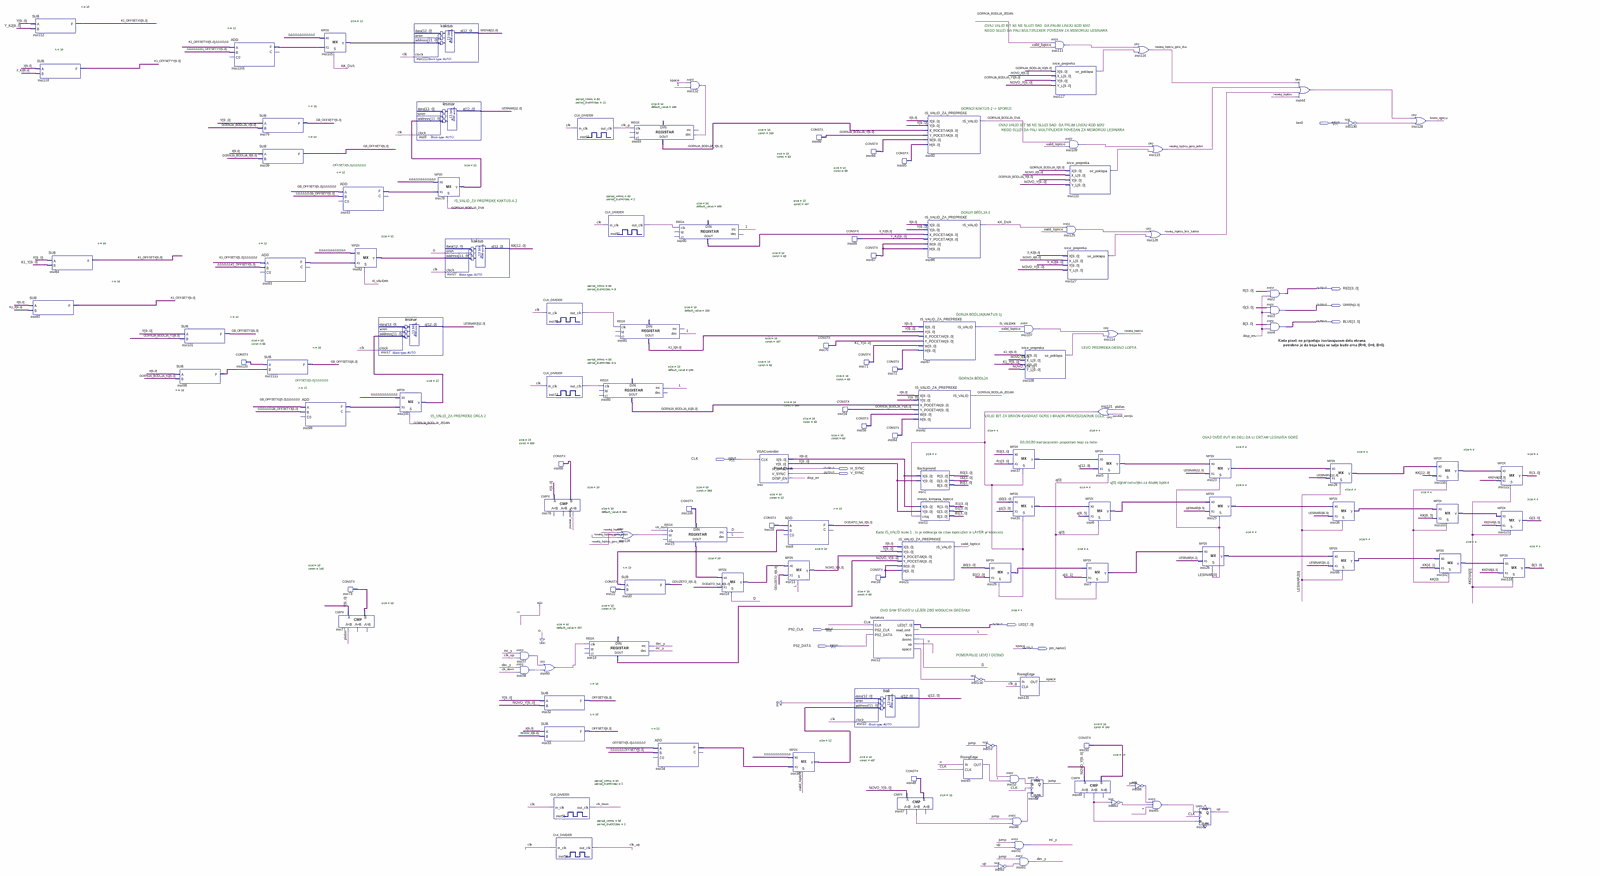
[diagram p0: schematic sheet, whole]
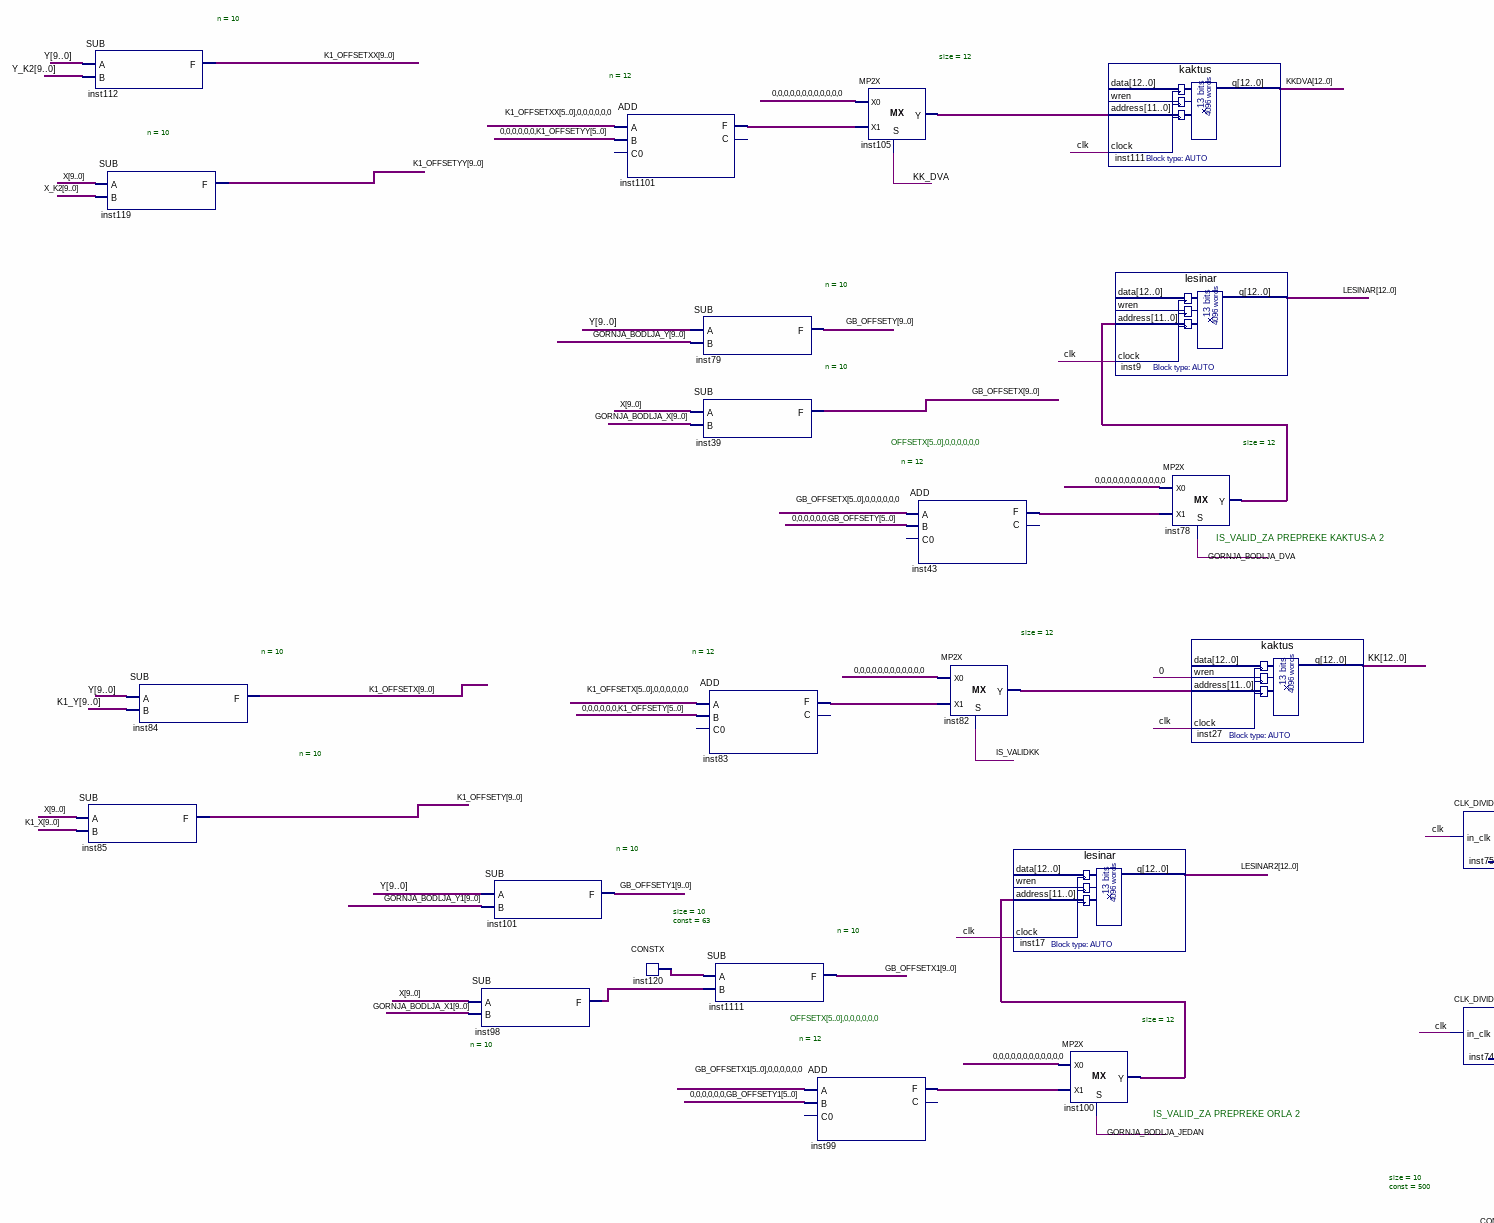
[diagram p1: schematic sheet, upper left part]
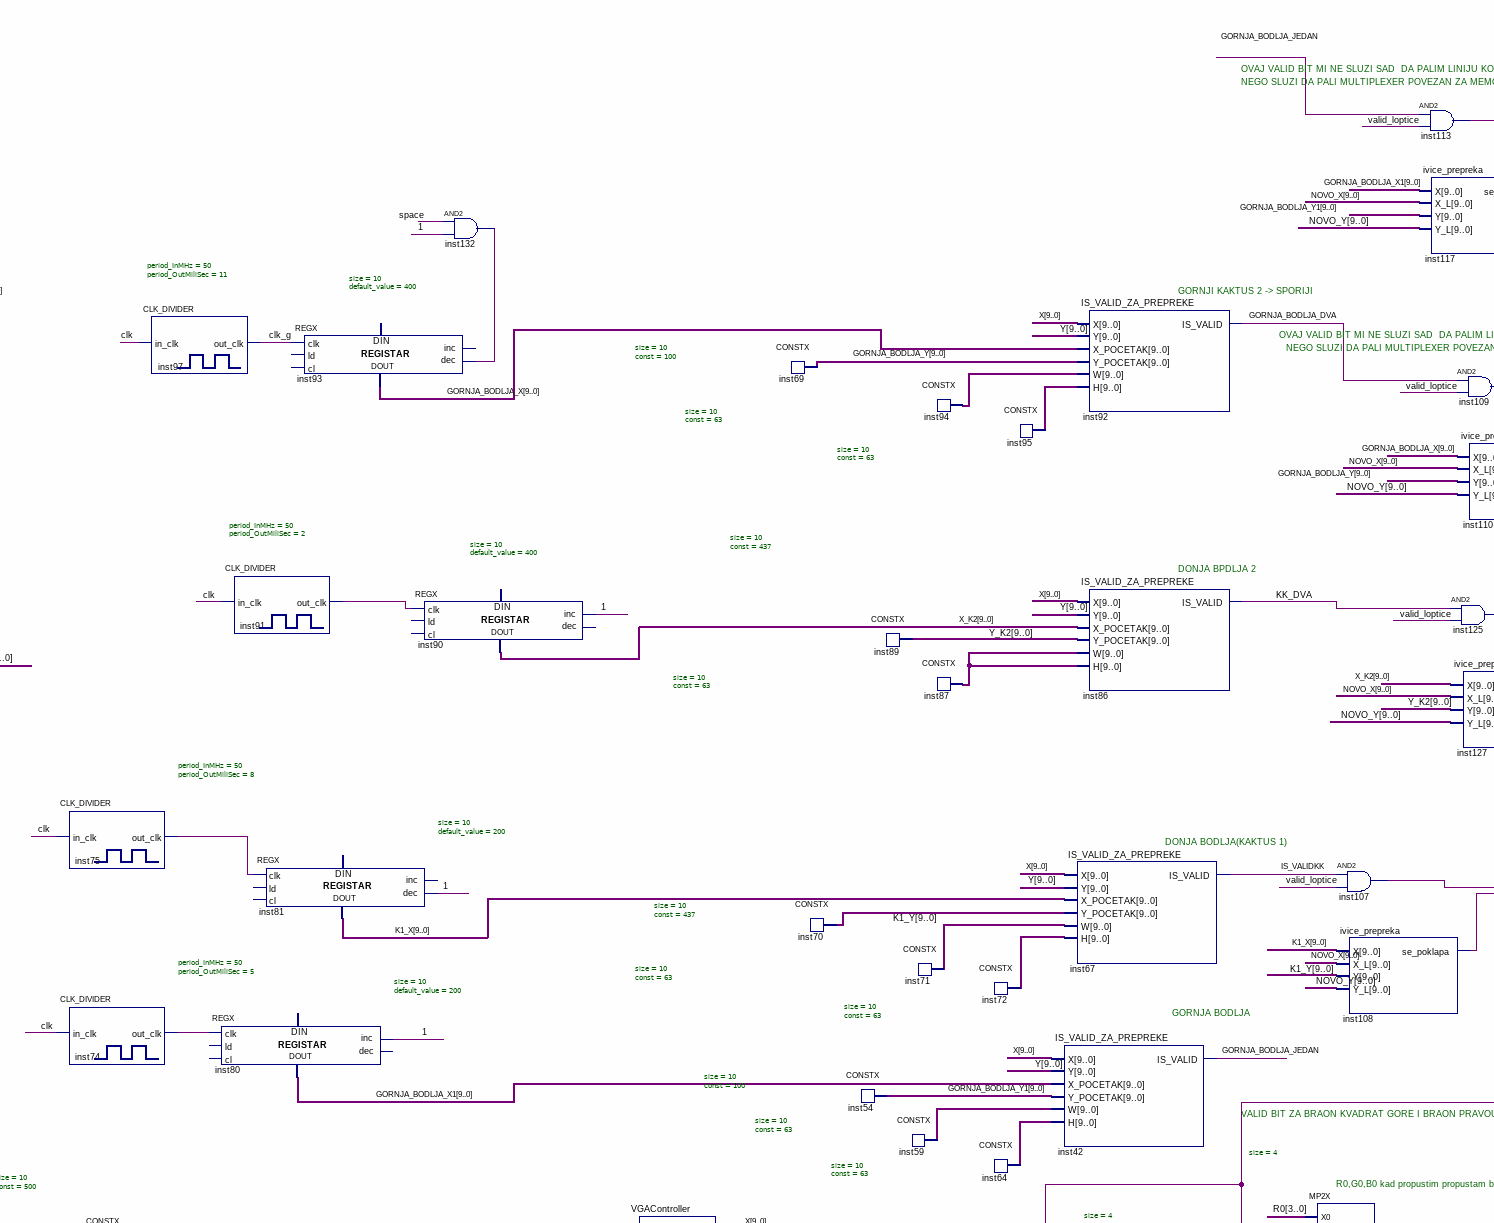
[diagram p2: schematic sheet, upper centre part]
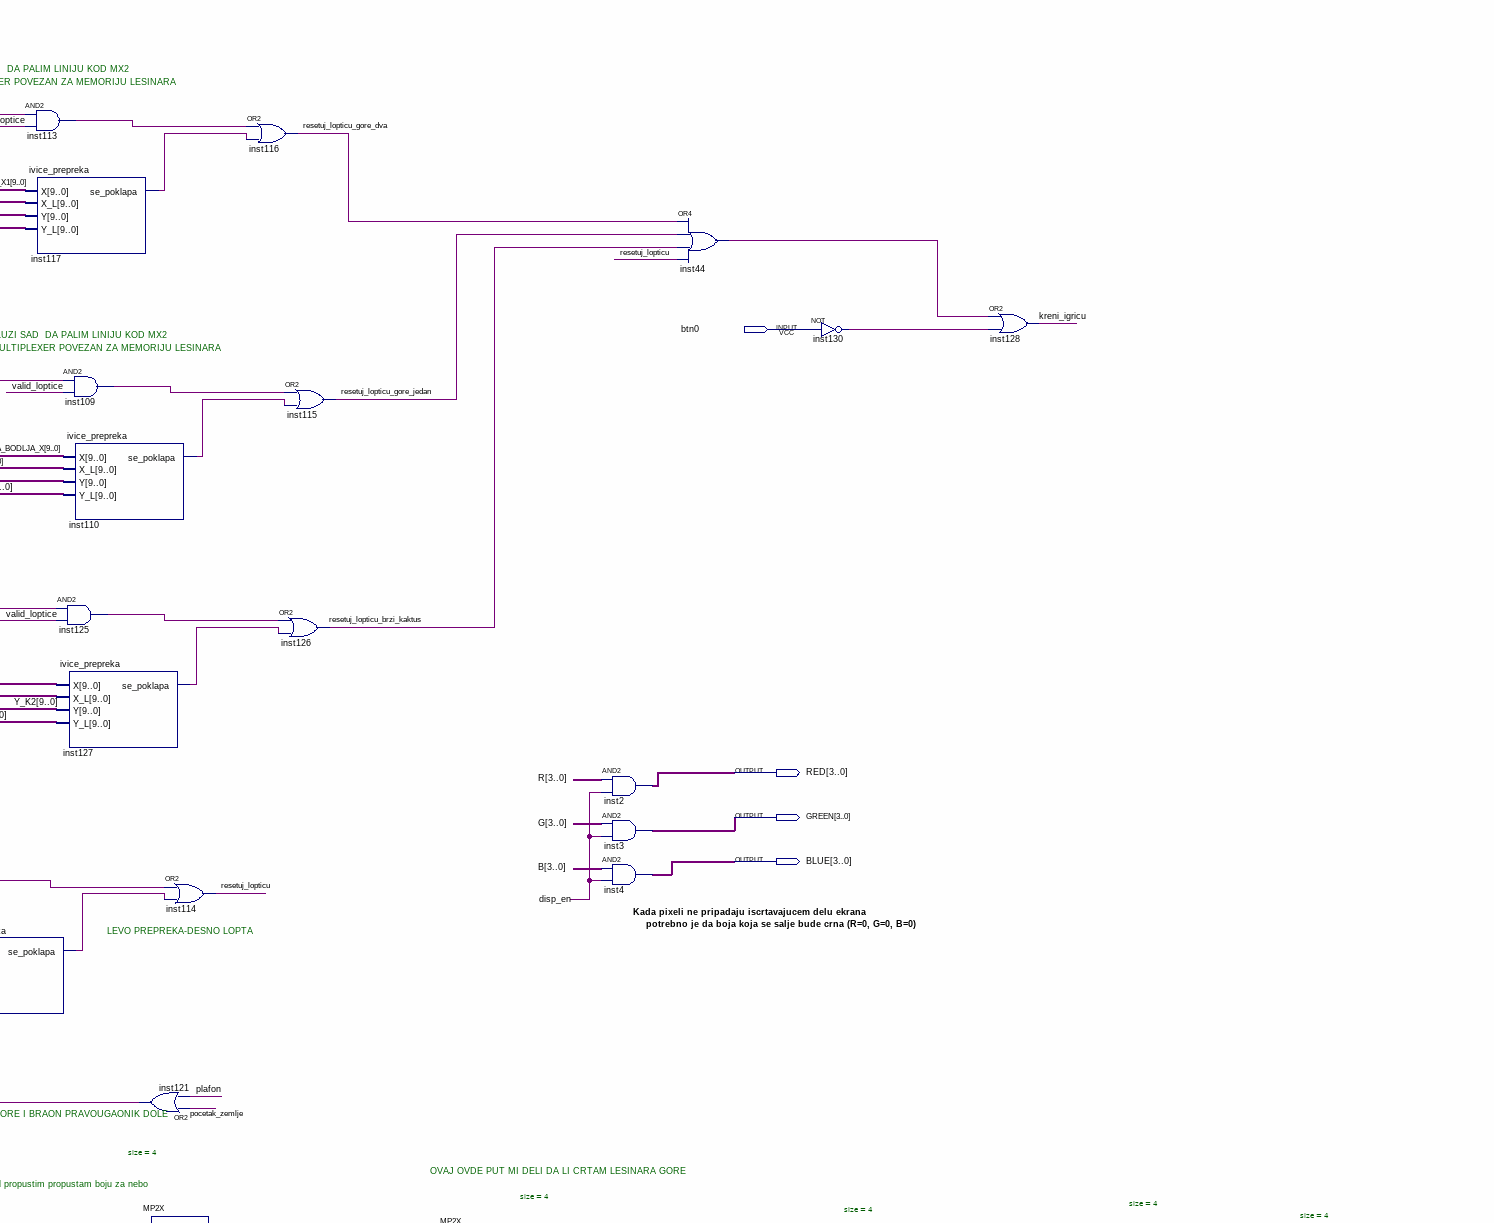
[diagram p3: schematic sheet, upper right part]
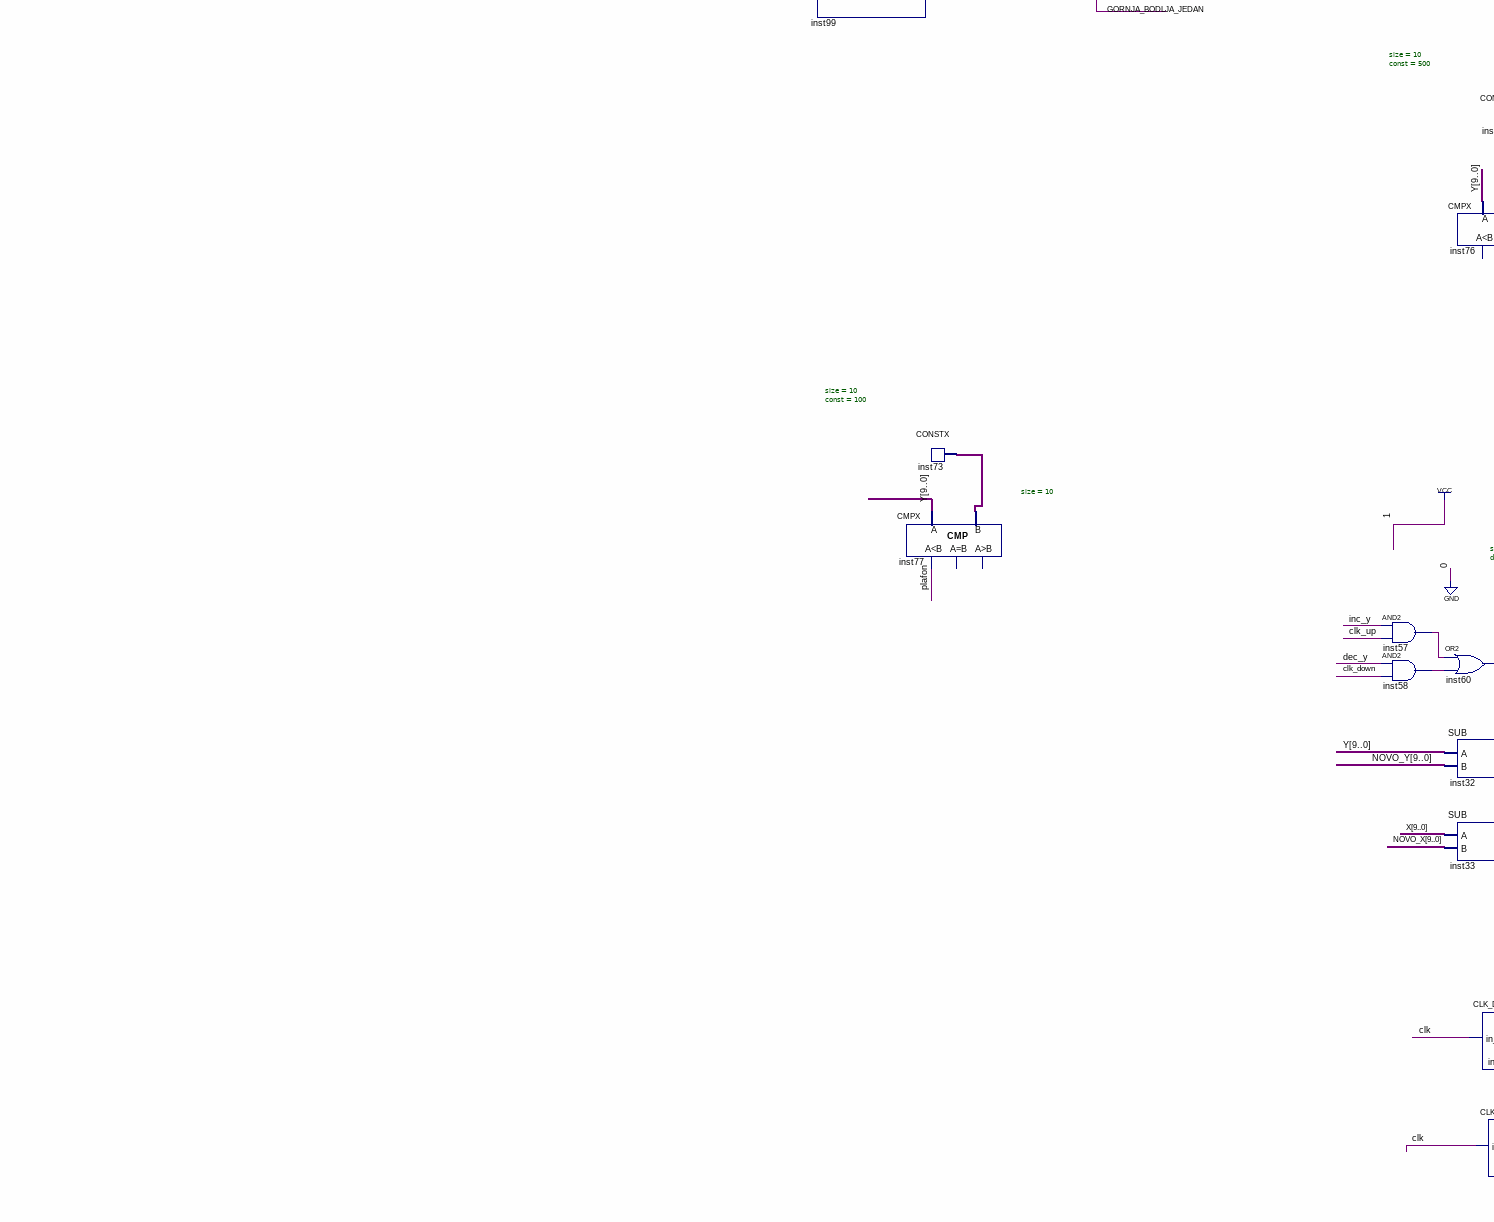
[diagram p4: schematic sheet, lower left part]
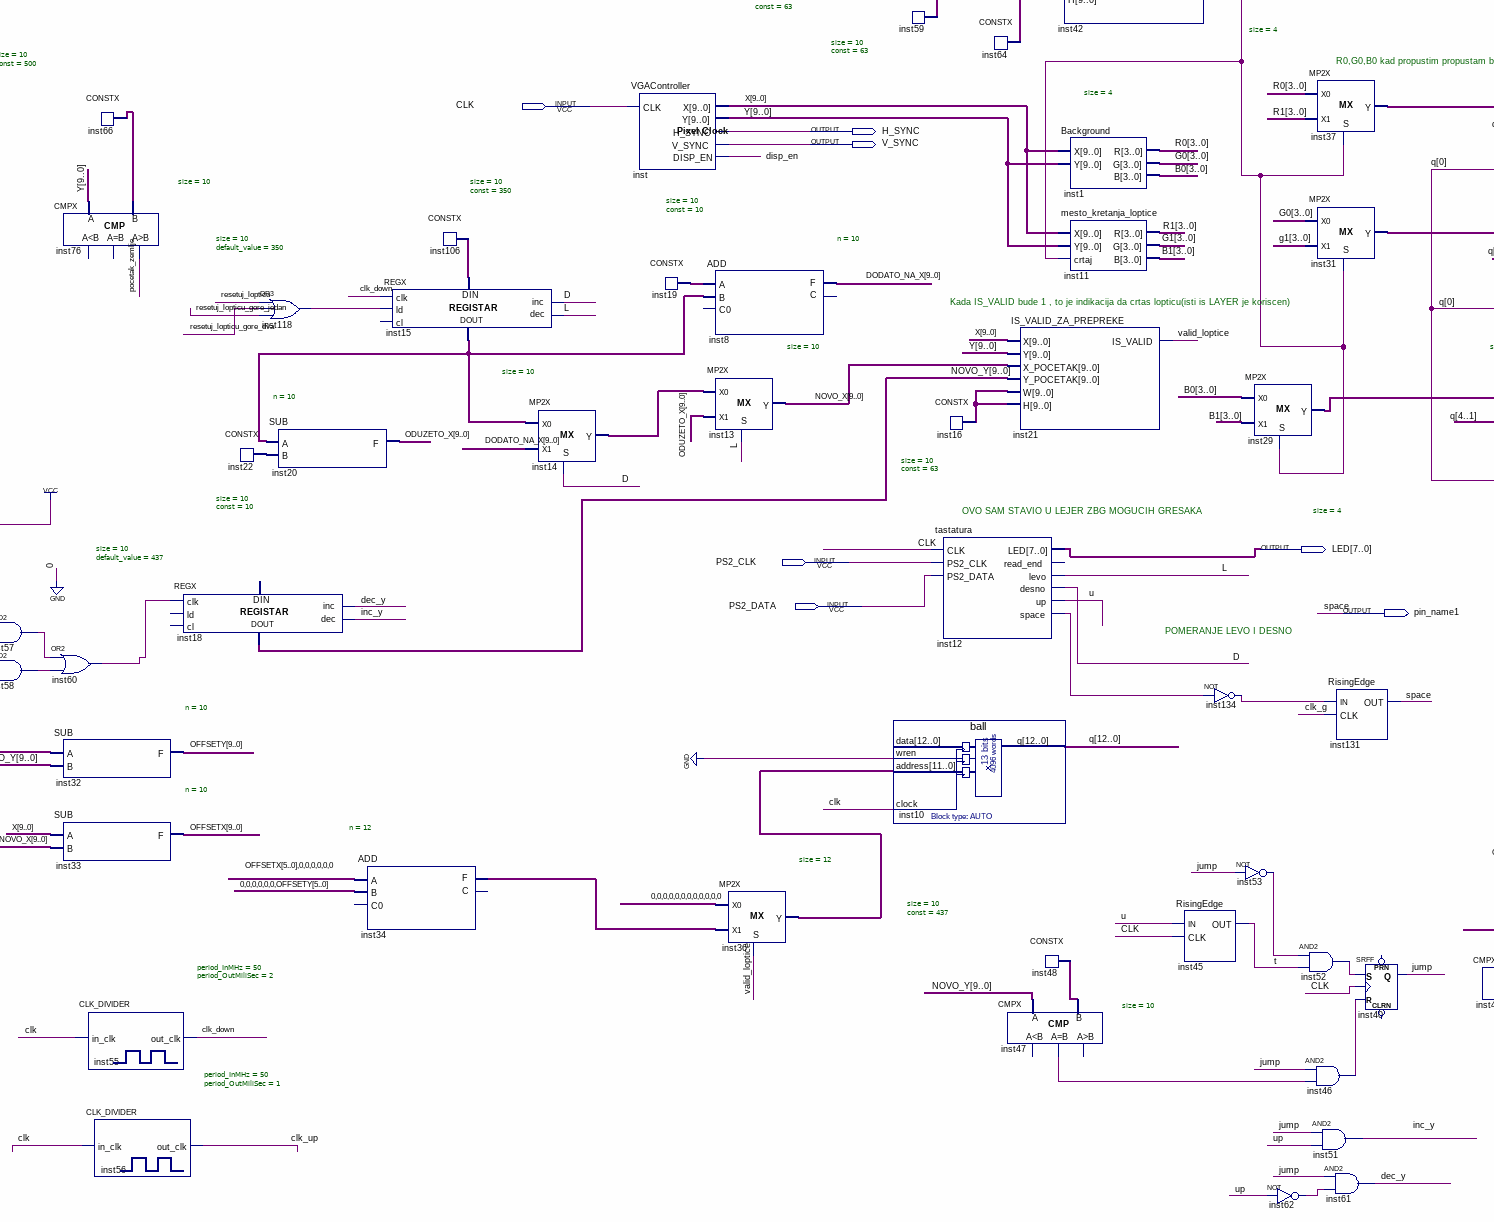
[diagram p5: schematic sheet, lower centre part]
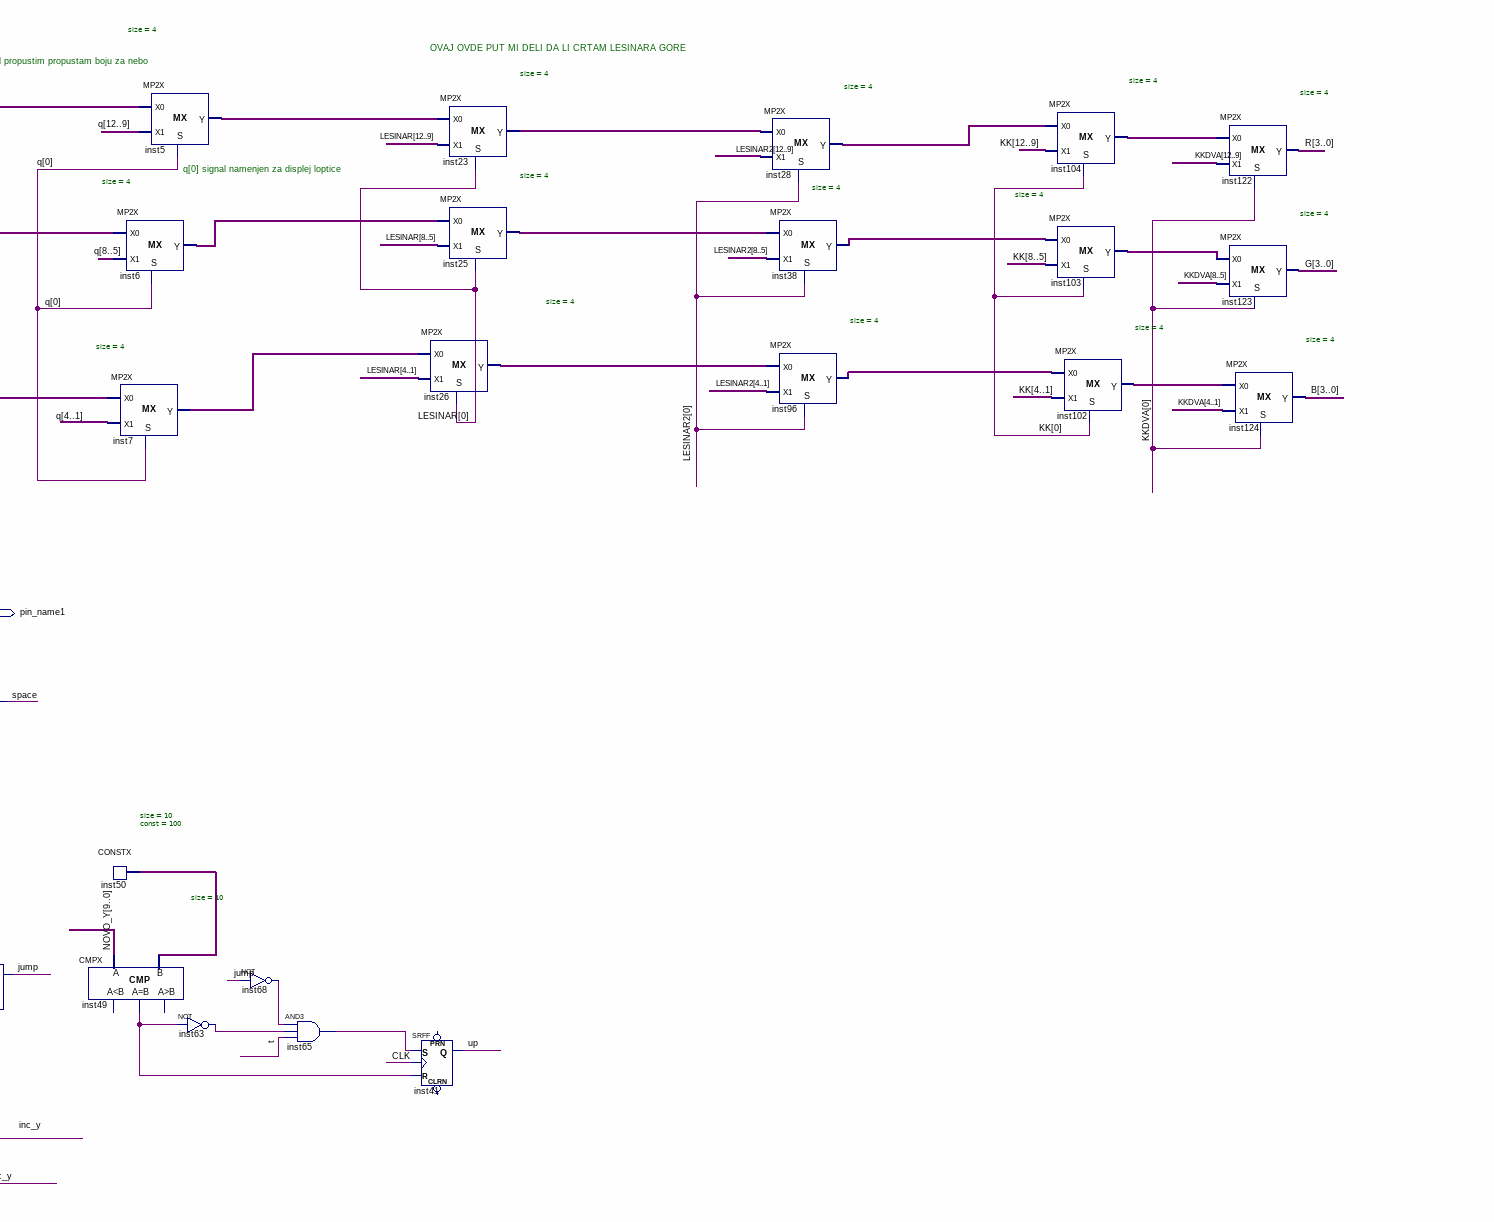
[diagram p6: schematic sheet, lower right part]
// Quartus schematic Lab2Demo.bdf as structural Verilog: 131 symbols, 11 pins
module Lab2Demo (
  input  btn0,
  input  CLK,
  input  PS2_CLK,
  input  PS2_DATA,
  output [3:0] RED,
  output [3:0] GREEN,
  output [3:0] BLUE,
  output H_SYNC,
  output V_SYNC,
  output [7:0] LED,
  output pin_name1
);

  wire clk_down, clk_g, clk_up, D, dec_y, disp_en, GORNJA_BODLJA_DVA, GORNJA_BODLJA_JEDAN, inc_y,
       inst12_space, inst44_out, inst46_out, inst47_eq, inst49_eq, inst52_out, inst53_out, inst57_out,
       inst58_out, inst60_out, inst62_out, inst63_out, inst65_out, inst68_out, inst74_out_clk,
       inst75_out_clk, inst91_out_clk, inst107_out, inst108_se_poklapa, inst109_out, inst110_se_poklapa,
       inst113_out, inst117_se_poklapa, inst118_out, inst121_out, inst125_out, inst127_se_poklapa,
       inst130_out, inst132_out, inst134_out, IS_VALIDKK, jump, KK_DVA, kreni_igricu, L, plafon,
       pocetak_zemlje, resetuj_lopticu, resetuj_lopticu_brzi_kaktus, resetuj_lopticu_gore_dva,
       resetuj_lopticu_gore_jedan, t, u, up, valid_loptice;
  wire [3:0] B, B0, B1, G, G0, g1, inst5_y, inst6_y, inst7_y, inst23_y, inst25_y, inst26_y, inst28_y,
       inst29_y, inst31_y, inst37_y, inst38_y, inst96_y, inst102_y, inst103_y, inst104_y, R, R0, R1;
  wire [9:0] DODATO_NA_X, GB_OFFSETX, GB_OFFSETX1, GB_OFFSETY, GB_OFFSETY1, GORNJA_BODLJA_X,
       GORNJA_BODLJA_X1, GORNJA_BODLJA_Y, GORNJA_BODLJA_Y1, inst14_y, inst15_data_out, inst16_data,
       inst19_data, inst22_data, inst48_data, inst50_data, inst59_data, inst64_data, inst66_data,
       inst71_data, inst72_data, inst73_data, inst87_data, inst94_data, inst95_data, inst98_f, inst106_data,
       inst120_data, K1_OFFSETX, K1_OFFSETXX, K1_OFFSETY, K1_OFFSETYY, K1_X, K1_Y, NOVO_X, NOVO_Y, ODUZETO_X,
       OFFSETX, OFFSETY, X, X_K2, Y, Y_K2;
  wire [11:0] inst34_f, inst36_y, inst43_f, inst78_y, inst82_y, inst83_f, inst99_f, inst100_y, inst105_y,
       inst1101_f;
  wire [12:0] KK, KKDVA, LESINAR, LESINAR2, q;

  SUB #(.n(10)) inst112 (.A(Y), .B(Y_K2), .F(K1_OFFSETXX));
  SUB #(.n(10)) inst85 (.A(X), .B(K1_X), .F(K1_OFFSETY));
  SUB #(.n(10)) inst119 (.A(X), .B(X_K2), .F(K1_OFFSETYY));
  SUB #(.n(10)) inst84 (.A(Y), .B(K1_Y), .F(K1_OFFSETX));
  SUB #(.n(10)) inst101 (.A(Y), .B(GORNJA_BODLJA_Y1), .F(GB_OFFSETY1));
  SUB #(.n(10)) inst98 (.A(X), .B(GORNJA_BODLJA_X1), .F(inst98_f));
  ADD #(.n(12)) inst1101 (
    .A({K1_OFFSETXX[5:0], {6{1'b0}}}), .B({{6{1'b0}}, K1_OFFSETYY[5:0]}), .F(inst1101_f));  // open: C0, C
  CONSTX #(.size(10), .\const (63)) inst120 (.data(inst120_data));
  SUB #(.n(10)) inst79 (.A(Y), .B(GORNJA_BODLJA_Y), .F(GB_OFFSETY));
  SUB #(.n(10)) inst39 (.A(X), .B(GORNJA_BODLJA_X), .F(GB_OFFSETX));
  ADD #(.n(12)) inst83 (
    .A({K1_OFFSETX[5:0], {6{1'b0}}}), .B({{6{1'b0}}, K1_OFFSETY[5:0]}), .F(inst83_f));  // open: C0, C
  SUB #(.n(10)) inst1111 (.A(inst120_data), .B(inst98_f), .F(GB_OFFSETX1));
  ADD #(.n(12)) inst99 (
    .A({GB_OFFSETX1[5:0], {6{1'b0}}}), .B({{6{1'b0}}, GB_OFFSETY1[5:0]}), .F(inst99_f));  // open: C0, C
  MP2X #(.size(12)) inst105 (.S(KK_DVA), .X0({12{1'b0}}), .X1(inst1101_f), .Y(inst105_y));
  CMPX #(.size(10)) inst77 (.A(Y), .B(inst73_data), .ls(plafon));  // open: eq, gr
  ADD #(.n(12)) inst43 (
    .A({GB_OFFSETX[5:0], {6{1'b0}}}), .B({{6{1'b0}}, GB_OFFSETY[5:0]}), .F(inst43_f));  // open: C0, C
  MP2X #(.size(12)) inst82 (.S(IS_VALIDKK), .X0({12{1'b0}}), .X1(inst83_f), .Y(inst82_y));
  CONSTX #(.size(10), .\const (100)) inst73 (.data(inst73_data));
  lesinar inst17 (.address(inst100_y), .clock(CLK), .q(LESINAR2));  // open: data, wren
  MP2X #(.size(12)) inst100 (.S(GORNJA_BODLJA_JEDAN), .X0({12{1'b0}}), .X1(inst99_f), .Y(inst100_y));
  kaktus inst111 (.address(inst105_y), .clock(CLK), .q(KKDVA));  // open: data, wren
  lesinar inst9 (.address(inst78_y), .clock(CLK), .q(LESINAR));  // open: data, wren
  MP2X #(.size(12)) inst78 (.S(GORNJA_BODLJA_DVA), .X0({12{1'b0}}), .X1(inst43_f), .Y(inst78_y));
  kaktus inst27 (.wren(1'b0), .address(inst82_y), .clock(CLK), .q(KK));  // open: data
  and inst57 (inst57_out, inc_y, clk_up);
  and inst58 (inst58_out, dec_y, clk_down);
  CLK_DIVIDER #(.period_InMHz(50), .period_OutMiliSec(8)) inst75 (.in_clk(CLK), .out_clk(inst75_out_clk));
  CLK_DIVIDER #(.period_InMHz(50), .period_OutMiliSec(5)) inst74 (.in_clk(CLK), .out_clk(inst74_out_clk));
  CMPX #(.size(10)) inst76 (.A(Y), .B(inst66_data), .gr(pocetak_zemlje));  // open: ls, eq
  or inst60 (inst60_out, inst57_out, inst58_out);
  SUB #(.n(10)) inst32 (.A(Y), .B(NOVO_Y), .F(OFFSETY));
  SUB #(.n(10)) inst33 (.A(X), .B(NOVO_X), .F(OFFSETX));
  CONSTX #(.size(10), .\const (500)) inst66 (.data(inst66_data));
  CLK_DIVIDER #(.period_InMHz(50), .period_OutMiliSec(2)) inst55 (.in_clk(CLK), .out_clk(clk_down));
  CLK_DIVIDER #(.period_InMHz(50), .period_OutMiliSec(1)) inst56 (.in_clk(CLK), .out_clk(clk_up));
  CLK_DIVIDER #(.period_InMHz(50), .period_OutMiliSec(11)) inst97 (.in_clk(CLK), .out_clk(clk_g));
  REGX #(.size(10), .default_value(200)) inst80 (
    .clk(inst74_out_clk), .inc(1'b1), .data_out(GORNJA_BODLJA_X1));  // open: ld, cl, dec, data_in
  REGX #(.size(10), .default_value(437)) inst18 (
    .clk(inst60_out), .inc(dec_y), .dec(inc_y), .data_out(NOVO_Y));  // open: ld, cl, data_in
  CLK_DIVIDER #(.period_InMHz(50), .period_OutMiliSec(2)) inst91 (.in_clk(CLK), .out_clk(inst91_out_clk));
  REGX #(.size(10), .default_value(200)) inst81 (
    .clk(inst75_out_clk), .dec(1'b1), .data_out(K1_X));  // open: ld, cl, inc, data_in
  or inst118 (inst118_out, resetuj_lopticu, resetuj_lopticu_gore_dva, resetuj_lopticu_gore_jedan);
  SUB #(.n(10)) inst20 (.A(inst15_data_out), .B(inst22_data), .F(ODUZETO_X));
  CONSTX #(.size(10), .\const (10)) inst22 (.data(inst22_data));
  REGX #(.size(10), .default_value(400)) inst93 (
    .clk(clk_g), .dec(inst132_out), .data_out(GORNJA_BODLJA_X));  // open: ld, cl, inc, data_in
  ADD #(.n(12)) inst34 (.A({OFFSETX[5:0], {6{1'b0}}}), .B({{6{1'b0}}, OFFSETY[5:0]}), .F(inst34_f));  // open: C0, C
  REGX #(.size(10), .default_value(400)) inst90 (
    .clk(inst91_out_clk), .inc(1'b1), .data_out(X_K2));  // open: ld, cl, dec, data_in
  REGX #(.size(10), .default_value(350)) inst15 (
    .clk(clk_down), .ld(inst118_out), .inc(D), .dec(L), .data_in(inst106_data), .data_out(inst15_data_out));  // open: cl
  and inst132 (inst132_out, pin_name1, 1'b1);
  CONSTX #(.size(10), .\const (350)) inst106 (.data(inst106_data));
  MP2X #(.size(10)) inst14 (.S(D), .X0(inst15_data_out), .X1(DODATO_NA_X), .Y(inst14_y));
  VGAController inst (.CLK(CLK), .X(X), .Y(Y), .H_SYNC(H_SYNC), .V_SYNC(V_SYNC), .DISP_EN(disp_en));
  CONSTX #(.size(10), .\const (10)) inst19 (.data(inst19_data));
  ADD #(.n(10)) inst8 (.A(inst19_data), .B(inst15_data_out), .F(DODATO_NA_X));  // open: C0, C
  MP2X #(.size(10)) inst13 (.S(L), .X0(inst14_y), .X1(ODUZETO_X), .Y(NOVO_X));
  MP2X #(.size(12)) inst36 (.S(valid_loptice), .X0({12{1'b0}}), .X1(inst34_f), .Y(inst36_y));
  CONSTX #(.size(10), .\const (100)) inst69 (.data(GORNJA_BODLJA_Y));
  CONSTX #(.size(10), .\const (437)) inst70 (.data(K1_Y));
  CONSTX #(.size(10), .\const (437)) inst89 (.data(Y_K2));
  CONSTX #(.size(10), .\const (100)) inst54 (.data(GORNJA_BODLJA_Y1));
  CONSTX #(.size(10), .\const (63)) inst94 (.data(inst94_data));
  CONSTX #(.size(10), .\const (63)) inst87 (.data(inst87_data));
  CONSTX #(.size(10), .\const (63)) inst71 (.data(inst71_data));
  CONSTX #(.size(10), .\const (63)) inst59 (.data(inst59_data));
  ball inst10 (.wren(1'b0), .address(inst36_y), .clock(CLK), .q(q));  // open: data
  CONSTX #(.size(10), .\const (63)) inst72 (.data(inst72_data));
  CONSTX #(.size(10), .\const (63)) inst64 (.data(inst64_data));
  CONSTX #(.size(10), .\const (63)) inst16 (.data(inst16_data));
  tastatura inst12 (
    .CLK(CLK), .PS2_CLK(PS2_CLK), .PS2_DATA(PS2_DATA), .LED(LED), .levo(L), .desno(D), .up(u),
    .space(inst12_space));  // open: read_end
  CONSTX #(.size(10), .\const (63)) inst95 (.data(inst95_data));
  IS_VALID_ZA_PREPREKE inst21 (
    .X(X), .Y(Y), .X_POCETAK(NOVO_X), .Y_POCETAK(NOVO_Y), .W(inst16_data), .H(inst16_data),
    .IS_VALID(valid_loptice));
  CONSTX #(.size(10), .\const (437)) inst48 (.data(inst48_data));
  CMPX #(.size(10)) inst47 (.A(NOVO_Y), .B(inst48_data), .eq(inst47_eq));  // open: ls, gr
  IS_VALID_ZA_PREPREKE inst92 (
    .X(X), .Y(Y), .X_POCETAK(GORNJA_BODLJA_X), .Y_POCETAK(GORNJA_BODLJA_Y), .W(inst94_data), .H(inst95_data),
    .IS_VALID(GORNJA_BODLJA_DVA));
  IS_VALID_ZA_PREPREKE inst86 (
    .X(X), .Y(Y), .X_POCETAK(X_K2), .Y_POCETAK(Y_K2), .W(inst87_data), .H(inst87_data), .IS_VALID(KK_DVA));
  IS_VALID_ZA_PREPREKE inst67 (
    .X(X), .Y(Y), .X_POCETAK(K1_X), .Y_POCETAK(K1_Y), .W(inst71_data), .H(inst72_data), .IS_VALID(IS_VALIDKK));
  IS_VALID_ZA_PREPREKE inst42 (
    .X(X), .Y(Y), .X_POCETAK(GORNJA_BODLJA_X1), .Y_POCETAK(GORNJA_BODLJA_Y1), .W(inst59_data),
    .H(inst64_data), .IS_VALID(GORNJA_BODLJA_JEDAN));
  Background inst1 (.X(X), .Y(Y), .R(R0), .G(G0), .B(B0));
  mesto_kretanja_loptice inst11 (.X(X), .Y(Y), .crtaj(inst121_out), .R(R1), .G(g1), .B(B1));
  RisingEdge inst45 (.IN(u), .CLK(CLK), .OUT(t));
  not inst134 (inst134_out, inst12_space);
  MP2X #(.size(4)) inst29 (.S(inst121_out), .X0(B0), .X1(B1), .Y(inst29_y));
  not inst53 (inst53_out, jump);
  not inst62 (inst62_out, up);
  MP2X #(.size(4)) inst37 (.S(inst121_out), .X0(R0), .X1(R1), .Y(inst37_y));
  MP2X #(.size(4)) inst31 (.S(inst121_out), .X0(G0), .X1(g1), .Y(inst31_y));
  RisingEdge inst131 (.IN(inst134_out), .CLK(clk_g), .OUT(pin_name1));
  and inst52 (inst52_out, inst53_out, t);
  and inst46 (inst46_out, jump, inst47_eq);
  and inst51 (inc_y, jump, up);
  and inst61 (dec_y, jump, inst62_out);
  and inst107 (inst107_out, IS_VALIDKK, valid_loptice);
  ivice_prepreka inst108 (.X(K1_X), .X_L(NOVO_X), .Y(K1_Y), .Y_L(NOVO_Y), .se_poklapa(inst108_se_poklapa));
  SRFF inst40 (.S(inst52_out), .R(inst46_out), .CLK(CLK), .Q(jump));  // open: PRN, CLRN
  and inst113 (inst113_out, GORNJA_BODLJA_JEDAN, valid_loptice);
  ivice_prepreka inst117 (
    .X(GORNJA_BODLJA_X1), .X_L(NOVO_X), .Y(GORNJA_BODLJA_Y1), .Y_L(NOVO_Y), .se_poklapa(inst117_se_poklapa));
  and inst109 (inst109_out, GORNJA_BODLJA_DVA, valid_loptice);
  ivice_prepreka inst110 (
    .X(GORNJA_BODLJA_X), .X_L(NOVO_X), .Y(GORNJA_BODLJA_Y), .Y_L(NOVO_Y), .se_poklapa(inst110_se_poklapa));
  and inst125 (inst125_out, KK_DVA, valid_loptice);
  ivice_prepreka inst127 (.X(X_K2), .X_L(NOVO_X), .Y(Y_K2), .Y_L(NOVO_Y), .se_poklapa(inst127_se_poklapa));
  CMPX #(.size(10)) inst49 (.A(NOVO_Y), .B(inst50_data), .eq(inst49_eq));  // open: ls, gr
  or inst121 (inst121_out, pocetak_zemlje, plafon);
  MP2X #(.size(4)) inst5 (.S(q[0]), .X0(inst37_y), .X1(q[12:9]), .Y(inst5_y));
  MP2X #(.size(4)) inst6 (.S(q[0]), .X0(inst31_y), .X1(q[8:5]), .Y(inst6_y));
  MP2X #(.size(4)) inst7 (.S(q[0]), .X0(inst29_y), .X1(q[4:1]), .Y(inst7_y));
  CONSTX #(.size(10), .\const (100)) inst50 (.data(inst50_data));
  or inst114 (resetuj_lopticu, inst107_out, inst108_se_poklapa);
  not inst63 (inst63_out, inst49_eq);
  not inst68 (inst68_out, jump);
  or inst116 (resetuj_lopticu_gore_dva, inst113_out, inst117_se_poklapa);
  or inst115 (resetuj_lopticu_gore_jedan, inst109_out, inst110_se_poklapa);
  or inst126 (resetuj_lopticu_brzi_kaktus, inst125_out, inst127_se_poklapa);
  and inst65 (inst65_out, inst68_out, inst63_out, t);
  MP2X #(.size(4)) inst23 (.S(LESINAR[0]), .X0(inst5_y), .X1(LESINAR[12:9]), .Y(inst23_y));
  MP2X #(.size(4)) inst25 (.S(LESINAR[0]), .X0(inst6_y), .X1(LESINAR[8:5]), .Y(inst25_y));
  MP2X #(.size(4)) inst26 (.S(LESINAR[0]), .X0(inst7_y), .X1(LESINAR[4:1]), .Y(inst26_y));
  SRFF inst41 (.S(inst65_out), .R(inst49_eq), .CLK(CLK), .Q(up));  // open: PRN, CLRN
  assign RED = R & {4{disp_en}};  // AND2 inst2, 4 bits wide
  assign GREEN = G & {4{disp_en}};  // AND2 inst3, 4 bits wide
  assign BLUE = B & {4{disp_en}};  // AND2 inst4, 4 bits wide
  or inst44 (inst44_out, resetuj_lopticu_gore_dva, resetuj_lopticu_gore_jedan, resetuj_lopticu_brzi_kaktus, resetuj_lopticu);
  MP2X #(.size(4)) inst28 (.S(LESINAR2[0]), .X0(inst23_y), .X1(LESINAR2[12:9]), .Y(inst28_y));
  MP2X #(.size(4)) inst38 (.S(LESINAR2[0]), .X0(inst25_y), .X1(LESINAR2[8:5]), .Y(inst38_y));
  MP2X #(.size(4)) inst96 (.S(LESINAR2[0]), .X0(inst26_y), .X1(LESINAR2[4:1]), .Y(inst96_y));
  not inst130 (inst130_out, btn0);
  or inst128 (kreni_igricu, inst44_out, inst130_out);
  MP2X #(.size(4)) inst104 (.S(KK[0]), .X0(inst28_y), .X1(KK[12:9]), .Y(inst104_y));
  MP2X #(.size(4)) inst103 (.S(KK[0]), .X0(inst38_y), .X1(KK[8:5]), .Y(inst103_y));
  MP2X #(.size(4)) inst102 (.S(KK[0]), .X0(inst96_y), .X1(KK[4:1]), .Y(inst102_y));
  MP2X #(.size(4)) inst122 (.S(KKDVA[0]), .X0(inst104_y), .X1(KKDVA[12:9]), .Y(R));
  MP2X #(.size(4)) inst123 (.S(KKDVA[0]), .X0(inst103_y), .X1(KKDVA[8:5]), .Y(G));
  MP2X #(.size(4)) inst124 (.S(KKDVA[0]), .X0(inst102_y), .X1(KKDVA[4:1]), .Y(B));

  // Other names for the same wires on the sheet: space = pin_name1

  // Notes on the sheet:
  //   OVAJ VALID BIT MI NE SLUZI SAD  DA PALIM LINIJU KOD MX2
  //   NEGO SLUZI DA PALI MULTIPLEXER POVEZAN ZA MEMORIJU LESINARA
  //   GORNJI KAKTUS 2 -> SPORIJI 
  //   OVAJ VALID BIT MI NE SLUZI SAD  DA PALIM LINIJU KOD MX2
  //   NEGO SLUZI DA PALI MULTIPLEXER POVEZAN ZA MEMORIJU LESINARA
  //   OFFSETX[5..0],0,0,0,0,0,0
  //   IS_VALID_ZA PREPREKE KAKTUS-A 2
  //   DONJA BPDLJA 2
  //   DONJA BODLJA(KAKTUS 1)
  //   Kada pixeli ne pripadaju iscrtavajucem delu ekrana
  //   potrebno je da boja koja se salje bude crna (R=0, G=0, B=0)
  //   LEVO PREPREKA-DESNO LOPTA
  //   GORNJA BODLJA
  //   OFFSETX[5..0],0,0,0,0,0,0
  //   IS_VALID_ZA PREPREKE ORLA 2
  //   VALID BIT ZA BRAON KVADRAT GORE I BRAON PRAVOUGAONIK DOLE
  //   OVAJ OVDE PUT MI DELI DA LI CRTAM LESINARA GORE
  //   R0,G0,B0 kad propustim propustam boju za nebo
  //   Pixel Clock
  //   q[0] signal namenjen za displej loptice
  //   Kada IS_VALID bude 1 , to je indikacija da crtas lopticu(isti is LAYER je koriscen)
  //   OVO SAM STAVIO U LEJER ZBG MOGUCIH GRESAKA
  //   POMERANJE LEVO I DESNO
endmodule
